# EAGLE design M311A (EAGLE 6.6.0)
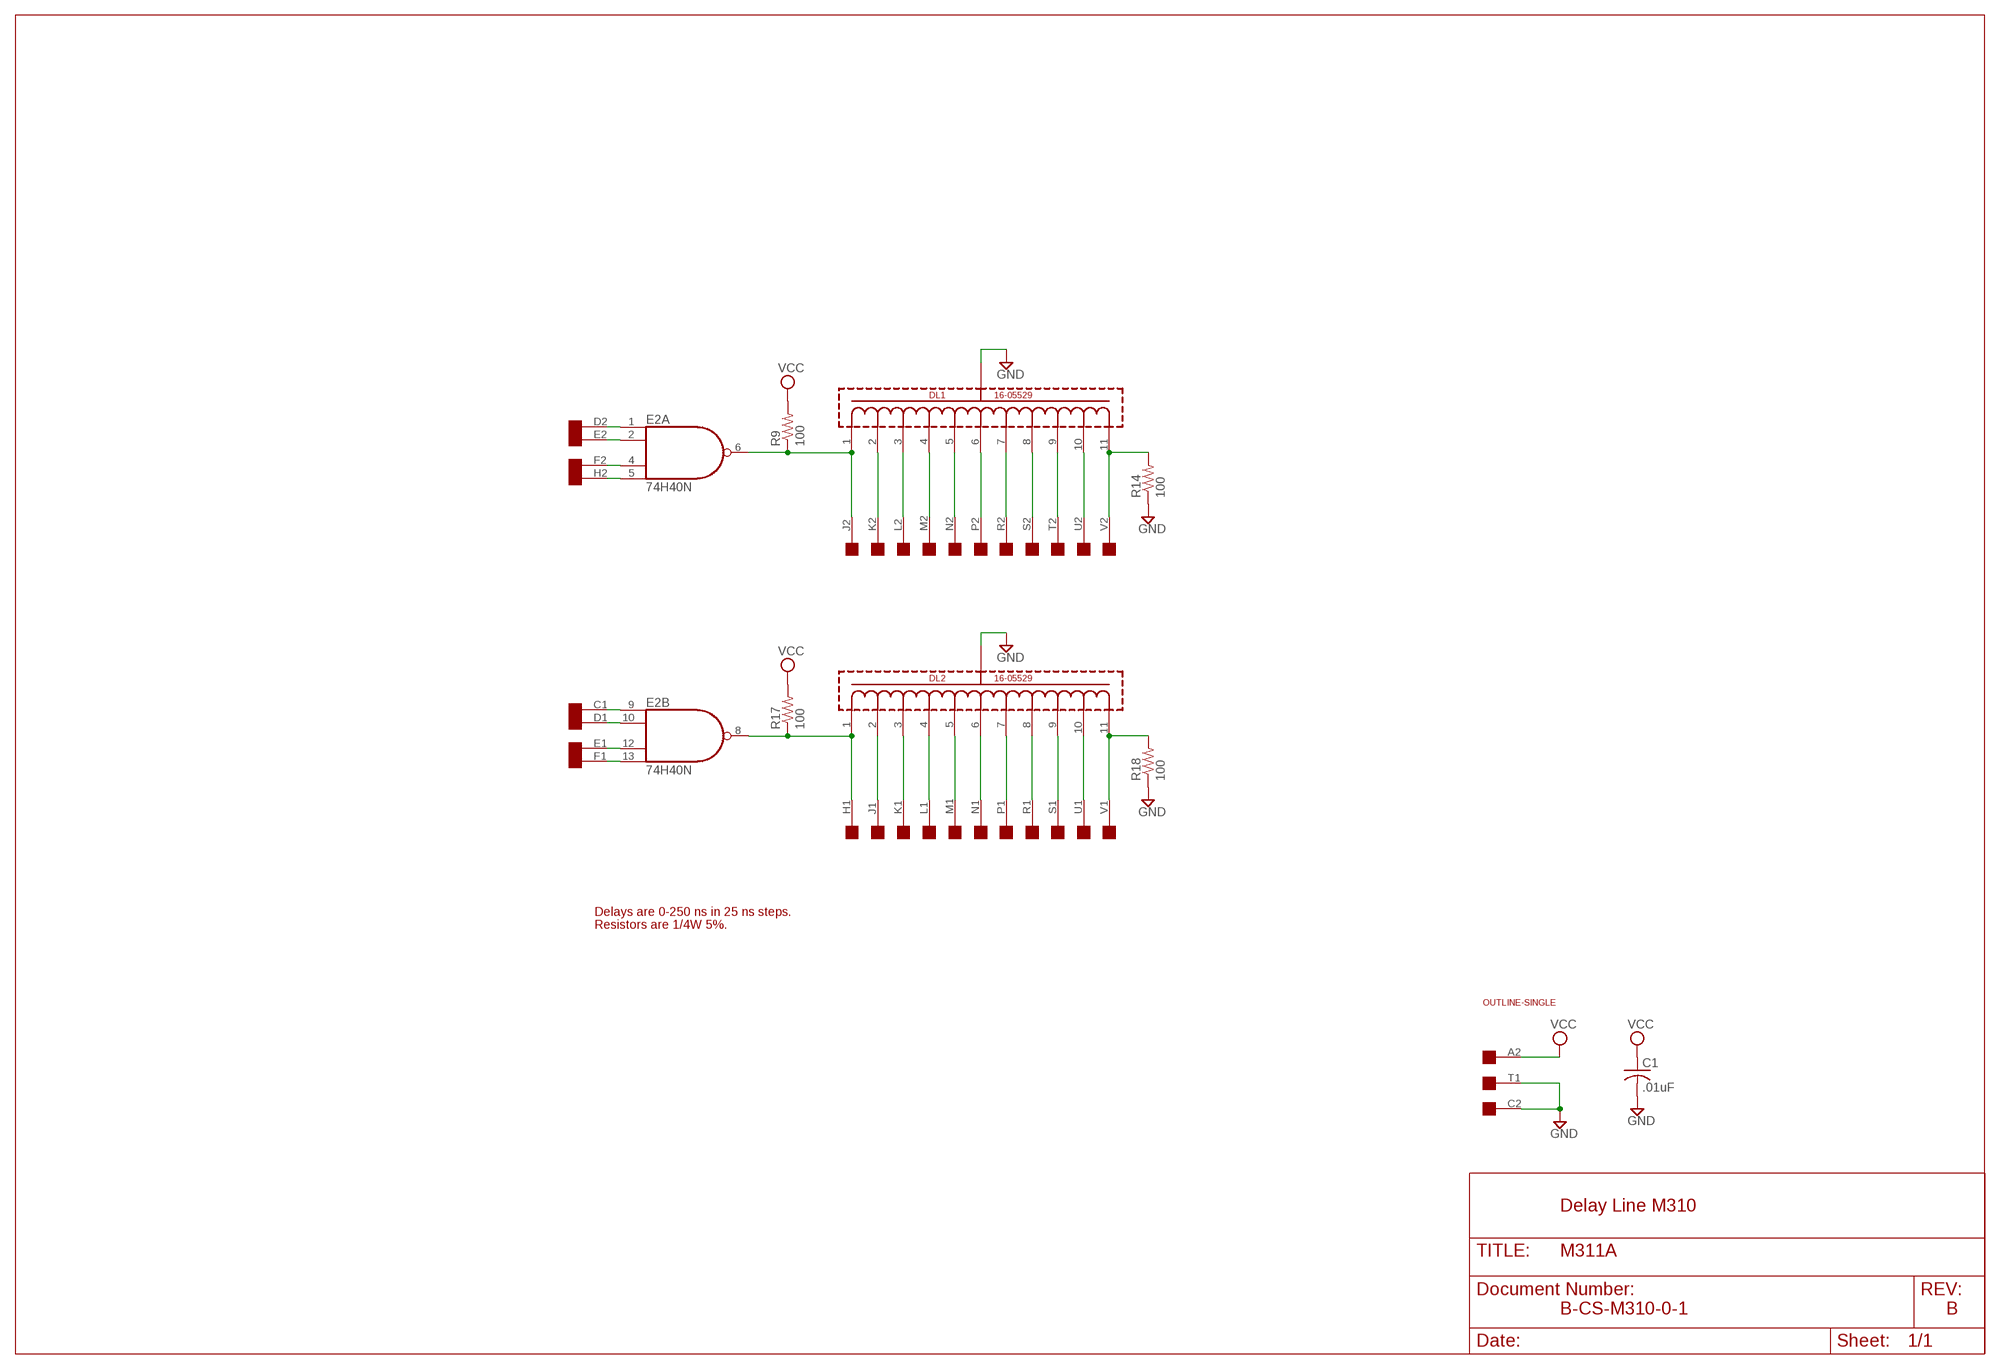
[diagram p0: schematic, sheet 1]

## Parts
C1  .01uF  C-US050-025X075  [C050-025X075]
DL1  16-05529  [16-05529]
DL2  16-05529  [16-05529]
E2  74H40N  74S20N  [DIL14]
R9  100  R-US_0207/10  [0207/10]
R14  100  R-US_0207/10  [0207/10]
R17  100  R-US_0207/10  [0207/10]
R18  100  R-US_0207/10  [0207/10]
U$1  OUTLINE-SINGLE  [SINGLE]
U$4  SINGLE  [EDGE-CON2]

## Nets
GND [power]: C1.2 DL1.12(GND) DL2.12(GND) R14.1 R18.1 U$4.C2 U$4.T1
N$1: DL1.11 R14.2 U$4.V2
N$2: E2.13(B:I3) U$4.F1
N$3: E2.12(B:I2) U$4.E1
N$4: DL1.10 U$4.U2
N$5: E2.10(B:I1) U$4.D1
N$6: DL1.9 U$4.T2
N$7: DL1.8 U$4.S2
N$8: E2.1(A:I0) U$4.D2
N$9: E2.2(A:I1) U$4.E2
N$10: E2.5(A:I3) U$4.H2
N$11: E2.9(B:I0) U$4.C1
N$12: DL1.7 U$4.R2
N$13: DL1.6 U$4.P2
N$14: DL1.5 U$4.N2
N$15: DL1.4 U$4.M2
N$16: DL1.3 U$4.L2
N$17: DL1.2 U$4.K2
N$18: DL2.11 R18.2 U$4.V1
N$19: DL2.10 U$4.U1
N$20: E2.4(A:I2) U$4.F2
N$21: DL1.1 E2.6(A:O) R9.1 U$4.J2
N$22: DL2.1 E2.8(B:O) R17.1 U$4.H1
N$23: DL2.9 U$4.S1
N$24: DL2.8 U$4.R1
N$25: DL2.7 U$4.P1
N$26: DL2.6 U$4.N1
N$27: DL2.5 U$4.M1
N$28: DL2.4 U$4.L1
N$29: DL2.3 U$4.K1
N$30: DL2.2 U$4.J1
VCC [power]: C1.1 R9.2 R17.2 U$4.A2
Unconnected: U$4.A1 U$4.B1 U$4.B2

## Notes on the sheet
- Delays are 0-250 ns in 25 ns steps.
- Resistors are 1/4W 5%.
- Delay Line M310
- B-CS-M310-0-1 | B

## Power pins joined to a net without a drawn wire
GND: E2.7(P:GND)
VCC: E2.14(P:VCC)

## Library data of the parts
C1 = rcl:C-US: CAPACITOR, American symbol
DL1 DL2 = dec-con:16-05529: Delay Line (M311 style)
E2 = 74xx-us:74*20: Dual 4-input NAND gate
R9 R14 R17 R18 = rcl:R-US_: RESISTOR, American symbol
U$1 = dec-con:OUTLINE-*: Board outlines for DEC boards.
U$4 = dec-con:SINGLE: Single-Height DEC board

## Net classes
1 power: width 0.813 mm

## Board
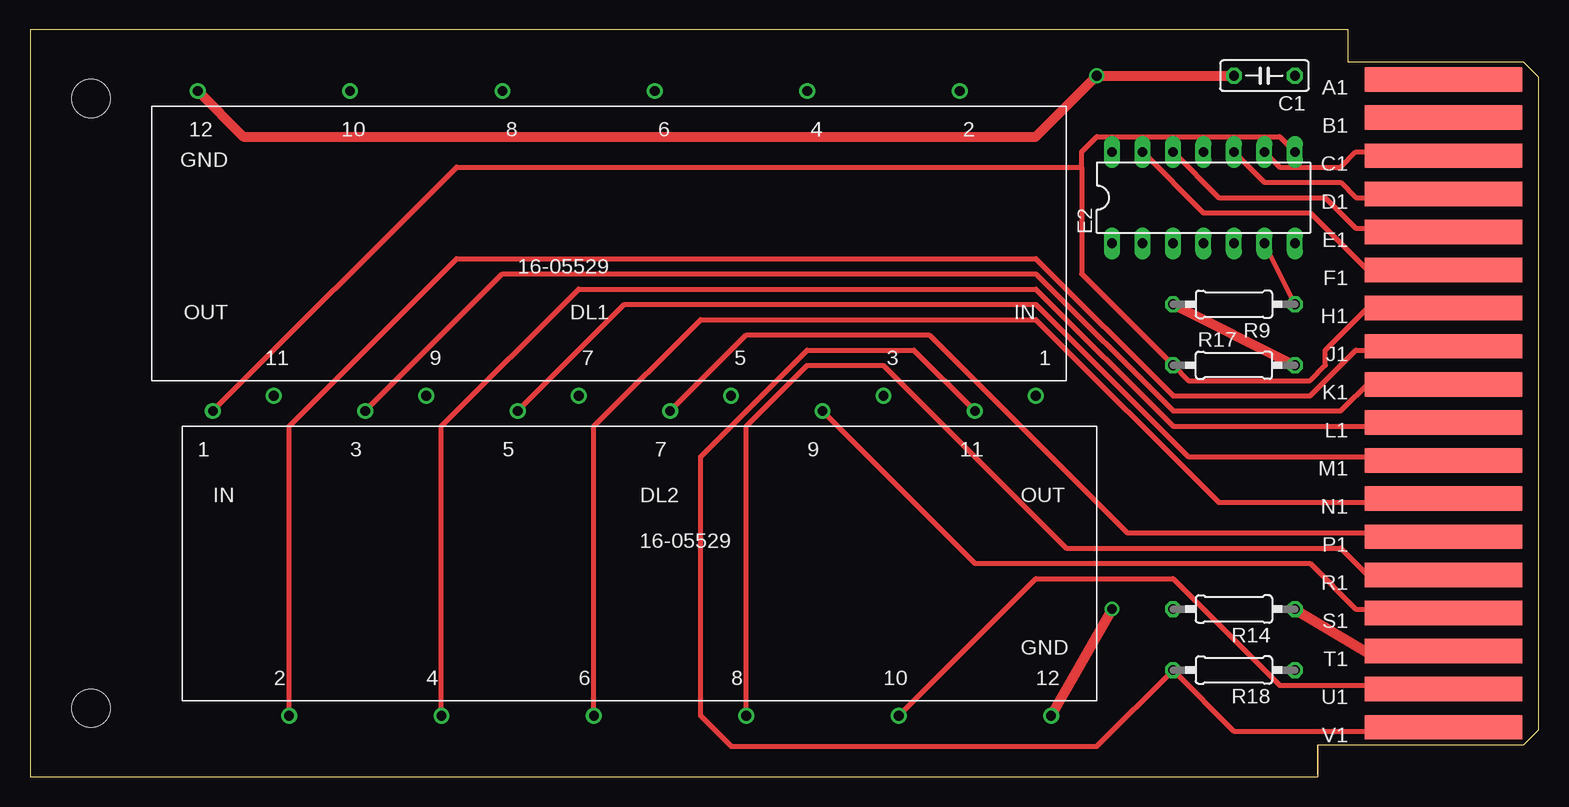
[diagram p1: board, top side]
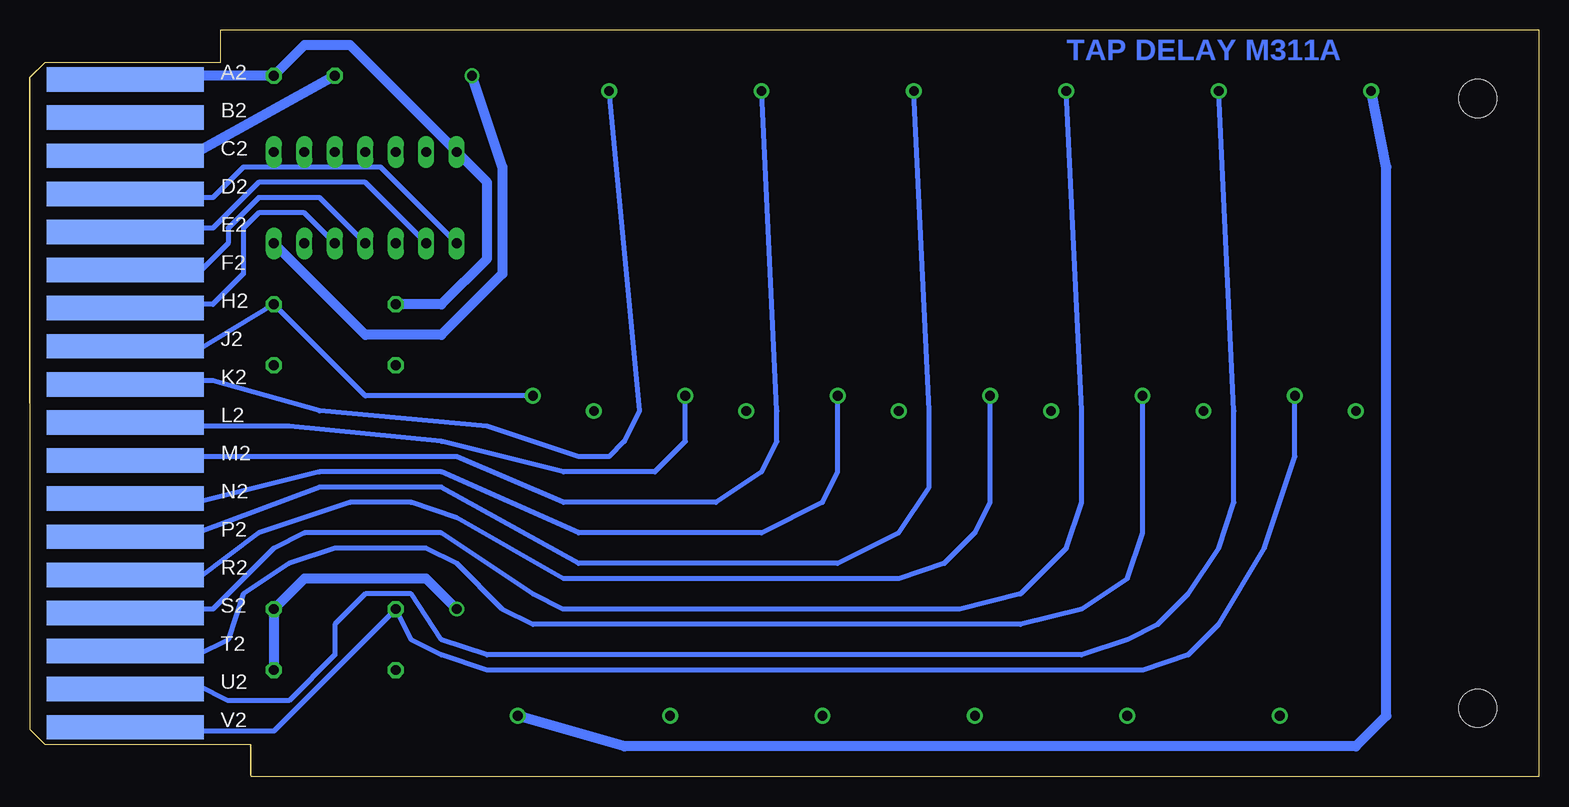
[diagram p2: board, bottom side, seen from below]

Size 125.73 x 62.23 mm. Coordinates in mm from the lower left corner, seen from the top.
Copper layers (1+16): Top 0.035mm / dielectric 1.5mm / Bottom 0.035mm
Design rules "16mils": minimum track width 16mil, minimum drill 32mil, track to track 15mil, track to pad 10mil, pad to pad 10mil, via to via 10mil, smd to smd 10mil, copper to edge 13mil, drill to drill 10mil, minimum pad ring 10mil, minimum via ring 8mil, stop-mask expansion 0mil, vias tented up to drill 0mil, thermal gap 10mil

### Footprints (pad centres in the part's own frame; a part is rotated, then mirrored left to right if it is on the bottom)
C050-025X075 = drill 0.813 octagon: 1 -2.54,0; 2 2.54,0
16-05529 = drill 0.813: 1 -35.56,12.7; 2 -29.21,-12.7; 3 -22.86,12.7; 4 -16.51,-12.7; 5 -10.16,12.7; 6 -3.81,-12.7; 7 2.54,12.7; 8 8.89,-12.7; 9 15.24,12.7; 10 21.59,-12.7; 11 27.94,12.7; 12 34.29,-12.7
DIL14 = drill 0.813 long: 1 -7.62,-3.81; 2 -5.08,-3.81; 3 -2.54,-3.81; 4 0,-3.81; 5 2.54,-3.81; 6 5.08,-3.81; 7 7.62,-3.81; 8 7.62,3.81; 9 5.08,3.81; 10 2.54,3.81; 11 0,3.81; 12 -2.54,3.81; 13 -5.08,3.81; 14 -7.62,3.81
0207/10 = drill 0.813 octagon: 1 -5.08,0; 2 5.08,0
SINGLE = hole 3.175: 120.65,56.515; 120.65,5.715
EDGE-CON2 = smd 13.106 x 2.032: A1 7.938,4.128; B1 7.938,7.303; C1 7.938,10.477; D1 7.938,13.652; E1 7.938,16.828; F1 7.938,20.003; H1 7.938,23.177; J1 7.938,26.352; K1 7.938,29.527; L1 7.938,32.703; M1 7.938,35.877; N1 7.938,39.053; P1 7.938,42.227; R1 7.938,45.403; S1 7.938,48.578; T1 7.938,51.752; U1 7.938,54.928; V1 7.938,58.102 | smd 13.106 x 2.032 bottom: A2 7.938,4.128; B2 7.938,7.303; C2 7.938,10.477; D2 7.938,13.652; E2 7.938,16.828; F2 7.938,20.003; H2 7.938,23.177; J2 7.938,26.352; K2 7.938,29.527; L2 7.938,32.703; M2 7.938,35.877; N2 7.938,39.053; P2 7.938,42.227; R2 7.938,45.403; S2 7.938,48.578; T2 7.938,51.752; U2 7.938,54.928; V2 7.938,58.102

### Placement (x,y rotation side)
C1  102.87,58.42 180 top
DL1  48.26,44.45 180 top
DL2  50.8,17.78 0 top
E2  97.79,48.26 0 top
R9  100.33,39.37 180 top
R14  100.33,13.97 180 top
R17  100.33,34.29 0 top
R18  100.33,8.89 180 top
U$1  125.73,62.23 180 top
U$4  125.73,62.23 180 top

### Tracks (layer width: path | path; a pad name or v marks a point on that pad's centre or on a via)
GND  (via drill 0.81)
  Top 0.813: C1.2 v88.9,58.42 83.82,53.34 17.78,53.34 DL1.12 | DL2.12 v90.17,13.97 | U$4.T1 116.84,10.16 111.76,10.16 R14.1
  Bottom 0.813: U$4.C2 117.17,51.74 116.84,52.07 111.76,52.07 C1.2 | v88.9,58.42 86.36,50.8 86.36,41.91 91.44,36.83 97.79,36.83 E2.7 | DL2.12 76.2,2.54 15.24,2.54 12.7,5.08 12.7,50.8 DL1.12 | R18.1 R14.1 102.87,16.51 92.71,16.51 v90.17,13.97
N$1
  Bottom 0.406: DL1.11 20.32,26.67 22.86,19.05 26.67,12.7 29.21,10.16 33.02,8.89 87.63,8.89 91.44,10.16 93.98,11.43 R14.2 105.41,3.81 116.84,3.81 U$4.V2
N$2
  Top 0.406: U$4.F1 117.12,42.19 116.84,41.91 111.76,41.91 106.68,46.99 97.79,46.99 E2.13
N$3
  Top 0.406: U$4.E1 117.17,45.39 116.84,45.72 110.49,45.72 107.95,48.26 99.06,48.26 E2.12
N$4
  Bottom 0.406: DL1.10 25.4,30.48 25.4,22.86 26.67,19.05 29.21,15.24 31.75,12.7 34.29,11.43 38.1,10.16 87.63,10.16 91.44,11.43 93.98,15.24 97.79,15.24 100.33,12.7 100.33,10.16 104.14,6.35 109.22,6.35 111.76,7.62 115.57,7.62 U$4.U2
N$5
  Top 0.406: U$4.D1 117.14,48.56 116.84,48.26 110.49,48.26 109.22,49.53 102.87,49.53 E2.10
N$6
  Bottom 0.406: DL1.9 33.02,20.32 34.29,16.51 38.1,13.97 43.18,12.7 83.82,12.7 86.36,13.97 90.17,17.78 92.71,19.05 100.33,19.05 104.14,17.78 107.95,15.24 109.22,11.43 111.76,10.16 116.84,10.16 U$4.T2
N$7
  Bottom 0.406: DL1.8 38.1,30.48 38.1,22.86 39.37,19.05 43.18,15.24 48.26,13.97 81.28,13.97 83.82,15.24 91.44,20.32 102.87,20.32 105.41,19.05 110.49,13.97 116.84,13.97 U$4.S2
N$8
  Bottom 0.406: E2.1 96.52,50.8 107.95,50.8 110.49,48.26 116.84,48.26 117.14,48.56 U$4.D2
N$9
  Bottom 0.406: E2.2 97.79,49.53 106.68,49.53 110.49,45.72 116.84,45.72 117.17,45.39 U$4.E2
N$10
  Bottom 0.406: E2.5 102.87,46.99 106.68,46.99 107.95,45.72 107.95,41.91 110.49,39.37 116.84,39.37 117.17,39.04 U$4.H2
N$11
  Top 0.406: U$4.C1 117.17,51.74 116.84,52.07 110.49,52.07 109.22,50.8 104.14,50.8 E2.9
N$12
  Bottom 0.406: DL1.7 45.72,22.86 46.99,20.32 49.53,17.78 53.34,16.51 81.28,16.51 90.17,21.59 93.98,22.86 99.06,22.86 106.68,20.32 111.76,16.51 116.84,16.51 U$4.R2
N$13
  Bottom 0.406: DL1.6 50.8,30.48 50.8,24.13 53.34,20.32 58.42,17.78 80.01,17.78 91.44,24.13 101.6,24.13 111.76,20.32 116.84,20.32 U$4.P2
N$14
  Bottom 0.406: DL1.5 58.42,25.4 59.69,22.86 64.77,20.32 80.01,20.32 91.44,25.4 101.6,25.4 111.76,22.86 116.84,22.86 U$4.N2
N$15
  Bottom 0.406: DL1.4 63.5,30.48 63.5,27.94 64.77,25.4 68.58,22.86 81.28,22.86 90.17,26.67 116.84,26.67 U$4.M2
N$16
  Bottom 0.406: DL1.3 71.12,27.94 73.66,25.4 81.28,25.4 91.44,27.94 104.14,29.21 116.84,29.21 U$4.L2
N$17
  Bottom 0.406: DL1.2 74.93,30.48 76.2,27.94 77.47,26.67 80.01,26.67 87.63,29.21 101.6,30.48 110.49,33.02 116.84,33.02 U$4.K2
N$18
  Top 0.406: U$4.V1 116.84,3.81 100.33,3.81 R18.2 88.9,2.54 58.42,2.54 55.88,5.08 55.88,26.67 64.77,35.56 73.66,35.56 DL2.11
N$19
  Top 0.406: U$4.U1 116.84,7.62 104.14,7.62 95.25,16.51 83.82,16.51 DL2.10
N$20
  Bottom 0.406: E2.4 101.6,48.26 106.68,48.26 109.22,45.72 109.22,44.45 111.76,41.91 116.84,41.91 117.12,42.19 U$4.F2
N$21
  Top 0.406: R9.1 E2.6
  Bottom 0.406: U$4.J2 117.17,35.89 116.84,35.56 111.76,35.56 R9.1 97.79,31.75 DL1.1
N$22
  Top 0.406: U$4.H1 117.17,39.04 116.84,39.37 111.76,39.37 107.95,35.56 107.95,34.29 106.68,33.02 96.52,33.02 R17.1 87.63,41.91 87.63,50.8 | 87.63,50.8 87.63,52.07 88.9,53.34 104.14,53.34 E2.8 | DL2.1 35.56,50.8 87.63,50.8
N$23
  Top 0.406: U$4.S1 116.84,13.97 110.49,13.97 106.68,17.78 78.74,17.78 DL2.9
N$24
  Top 0.406: U$4.R1 116.84,16.51 111.76,16.51 109.22,19.05 86.36,19.05 71.12,34.29 64.77,34.29 59.69,29.21 DL2.8
N$25
  Top 0.406: U$4.P1 116.84,20.32 91.44,20.32 74.93,36.83 59.69,36.83 DL2.7
N$26
  Top 0.406: U$4.N1 116.84,22.86 99.06,22.86 83.82,38.1 55.88,38.1 46.99,29.21 DL2.6
N$27
  Top 0.406: U$4.M1 116.84,26.67 96.52,26.67 83.82,39.37 49.53,39.37 DL2.5
N$28
  Top 0.406: U$4.L1 116.84,29.21 95.25,29.21 83.82,40.64 45.72,40.64 34.29,29.21 DL2.4
N$29
  Top 0.406: U$4.K1 116.84,33.02 111.76,33.02 109.22,30.48 95.25,30.48 83.82,41.91 39.37,41.91 DL2.3
N$30
  Top 0.406: U$4.J1 116.84,35.56 110.49,35.56 106.68,31.75 95.25,31.75 83.82,43.18 35.56,43.18 21.59,29.21 DL2.2
VCC
  Top 0.813: R9.2 R17.2
  Bottom 0.813: U$4.A2 117.24,58.02 116.84,58.42 C1.1 102.87,60.96 99.06,60.96 E2.14 87.63,49.53 87.63,43.18 91.44,39.37 R9.2

### Text on the board
Bottom: TAP DELAY M311A